# EAGLE design SparkFun_Ardumoto (EAGLE 7.7.0)

## Sheet 1 of 2
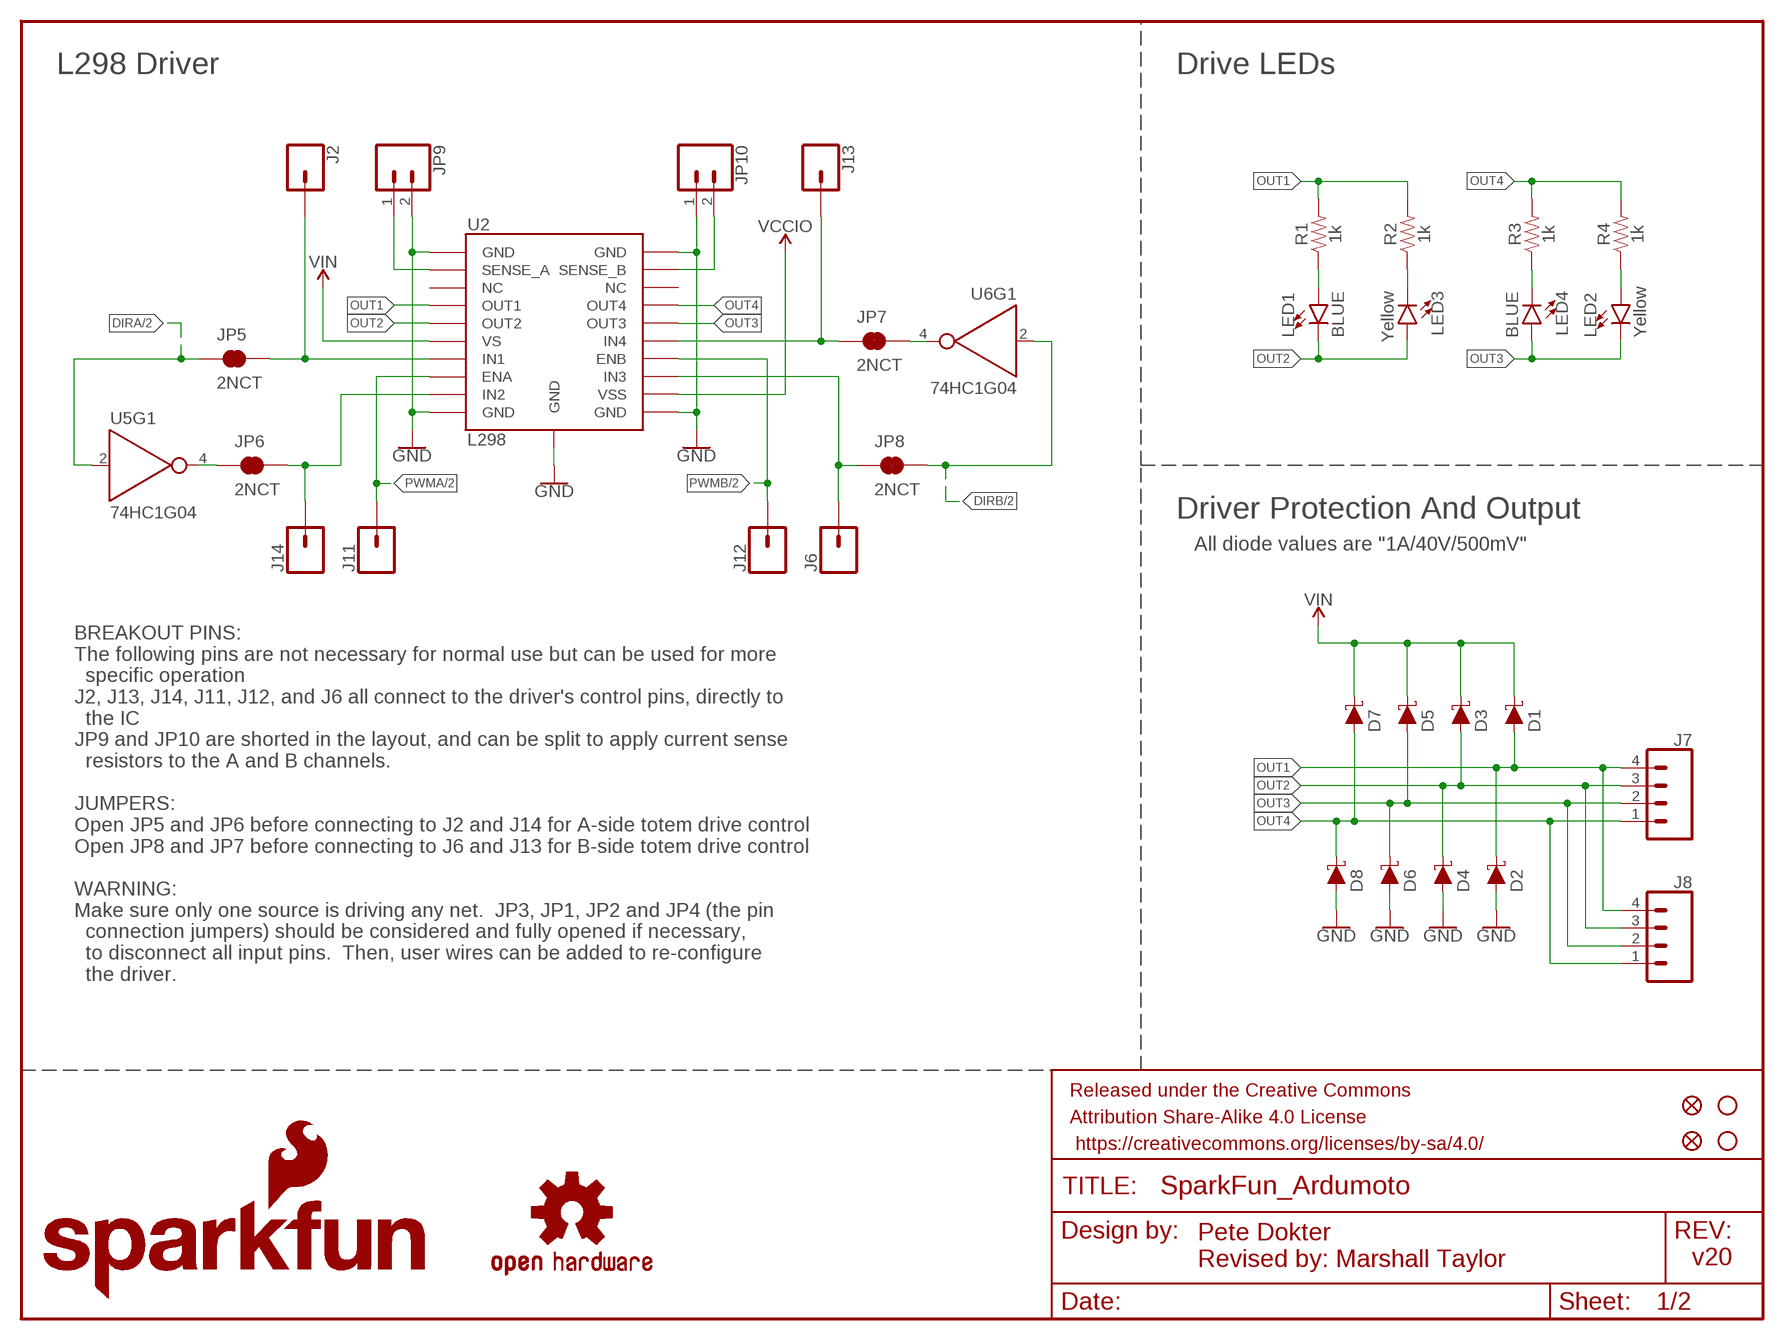
[diagram p0: schematic, sheet 1]

### Parts
D1  1A/40V/500mV  DIODE-SCHOTTKY-SS14  [SMA-DIODE]
D2  1A/40V/500mV  DIODE-SCHOTTKY-SS14  [SMA-DIODE]
D3  1A/40V/500mV  DIODE-SCHOTTKY-SS14  [SMA-DIODE]
D4  1A/40V/500mV  DIODE-SCHOTTKY-SS14  [SMA-DIODE]
D5  1A/40V/500mV  DIODE-SCHOTTKY-SS14  [SMA-DIODE]
D6  1A/40V/500mV  DIODE-SCHOTTKY-SS14  [SMA-DIODE]
D7  1A/40V/500mV  DIODE-SCHOTTKY-SS14  [SMA-DIODE]
D8  1A/40V/500mV  DIODE-SCHOTTKY-SS14  [SMA-DIODE]
FD1  FIDUCIALUFIDUCIAL  [MICRO-FIDUCIAL]
FD2  FIDUCIALUFIDUCIAL  [MICRO-FIDUCIAL]
FRAME2  FRAME-LETTERNO_PACKAGE  [DUMMY]
H1  STAND-OFF  [STAND-OFF]
H2  STAND-OFF  [STAND-OFF]
J2  CONN_01PTH_NO_SILK_YES_STOP  [1X01_NO_SILK]
J6  CONN_01PTH_NO_SILK_YES_STOP  [1X01_NO_SILK]
J7  CONN_04SCREW  [SCREWTERMINAL-3.5MM-4]
J8  CONN_04  [1X04]
J11  CONN_01PTH_NO_SILK_YES_STOP  [1X01_NO_SILK]
J12  CONN_01PTH_NO_SILK_YES_STOP  [1X01_NO_SILK]
J13  CONN_01PTH_NO_SILK_YES_STOP  [1X01_NO_SILK]
J14  CONN_01PTH_NO_SILK_YES_STOP  [1X01_NO_SILK]
JP5  2NCT  JUMPER-SMT_2_NC_TRACE_SILK  [SMT-JUMPER_2_NC_TRACE_SILK]
JP6  2NCT  JUMPER-SMT_2_NC_TRACE_SILK  [SMT-JUMPER_2_NC_TRACE_SILK]
JP7  2NCT  JUMPER-SMT_2_NC_TRACE_SILK  [SMT-JUMPER_2_NC_TRACE_SILK]
JP8  2NCT  JUMPER-SMT_2_NC_TRACE_SILK  [SMT-JUMPER_2_NC_TRACE_SILK]
JP9  CONN_021X02_NO_SILK  [1X02_NO_SILK]
JP10  CONN_021X02_NO_SILK  [1X02_NO_SILK]
LED1  BLUE  LED-BLUE0603  [LED-0603]
LED2  Yellow  LED-YELLOW0603  [LED-0603]
LED3  Yellow  LED-YELLOW0603  [LED-0603]
LED4  BLUE  LED-BLUE0603  [LED-0603]
LOGO2  SFE_LOGO_NAME_FLAME.1_INCH  [SFE_LOGO_NAME_FLAME_.1]
R1  1k  1KOHM-0603-1/10W-1%  [0603]
R2  1k  1KOHM-0603-1/10W-1%  [0603]
R3  1k  1KOHM-0603-1/10W-1%  [0603]
R4  1k  1KOHM-0603-1/10W-1%  [0603]
U2  L298  L298_SMD_W_PAD  [POWERSO20_L298_PAD]
U5  74HC1G04  [SOT353]
U6  74HC1G04  [SOT353]
U$1  OSHW-LOGOS  [OSHW-LOGO-S]

### Nets
DIRA: JP5.1 U5.2(A) ; also sheet 2
DIRB: JP8.2 U6.2(A) ; also sheet 2
GND: D2.A D4.A D6.A D8.A JP9.2 JP10.1 U2.1(GND) U2.10(GND) U2.11(GND) U2.20(GND) U2.PAD(GND) ; also sheet 2
IN1: J2.1 JP5.2 U2.7(IN1)
IN2: J14.1 JP6.2 U2.9(IN2)
IN3: J6.1 JP8.1 U2.13(IN3)
IN4: J13.1 JP7.1 U2.15(IN4)
N$4: LED1.A R1.1
N$5: LED3.C R2.1
N$8: LED4.C R3.1
N$9: LED2.A R4.1
NDIRA: JP6.1 U5.4(Y)
NDIRB: JP7.2 U6.4(Y)
OUT1: D1.A D2.C J7.4 J8.4 R1.2 R2.2 U2.4(OUT1)
OUT2: D3.A D4.C J7.3 J8.3 LED1.C LED3.A U2.5(OUT2)
OUT3: D5.A D6.C J7.2 J8.2 LED2.C LED4.A U2.16(OUT3)
OUT4: D7.A D8.C J7.1 J8.1 R3.2 R4.2 U2.17(OUT4)
PWMA: J11.1 U2.8(ENA) ; also sheet 2
PWMB: J12.1 U2.14(ENB) ; also sheet 2
SENA: JP9.1 U2.2(SENSE_A)
SENB: JP10.2 U2.19(SENSE_B)
VCCIO: U2.12(VSS) ; also sheet 2
VIN: D1.C D3.C D5.C D7.C U2.6(VS) ; also sheet 2
Unconnected: U2.3(NC) U2.18(NC)

### Notes on the sheet
- L298 Driver | Drive LEDs
- Driver Protection And Output
- All diode values are "1A/40V/500mV"
- BREAKOUT PINS:
  The following pins are not necessary for normal use but can be used for more
    specific operation
  J2, J13, J14, J11, J12, and J6 all connect to the driver's control pins, directly to
    the IC
  JP9 and JP10 are shorted in the layout, and can be split to apply current sense
    resistors to the A and B channels.
  
  JUMPERS:
  Open JP5 and JP6 before connecting to J2 and J14 for A-side totem drive control
  Open JP8 and JP7 before connecting to J6 and J13 for B-side totem drive control
  
  WARNING:
  Make sure only one source is driving any net.  JP3, JP1, JP2 and JP4 (the pin
    connection jumpers) should be considered and fully opened if necessary,
    to disconnect all input pins.  Then, user wires can be added to re-configure
    the driver.
- Pete Dokter
- Revised by: Marshall Taylor | v20

## Sheet 2 of 2
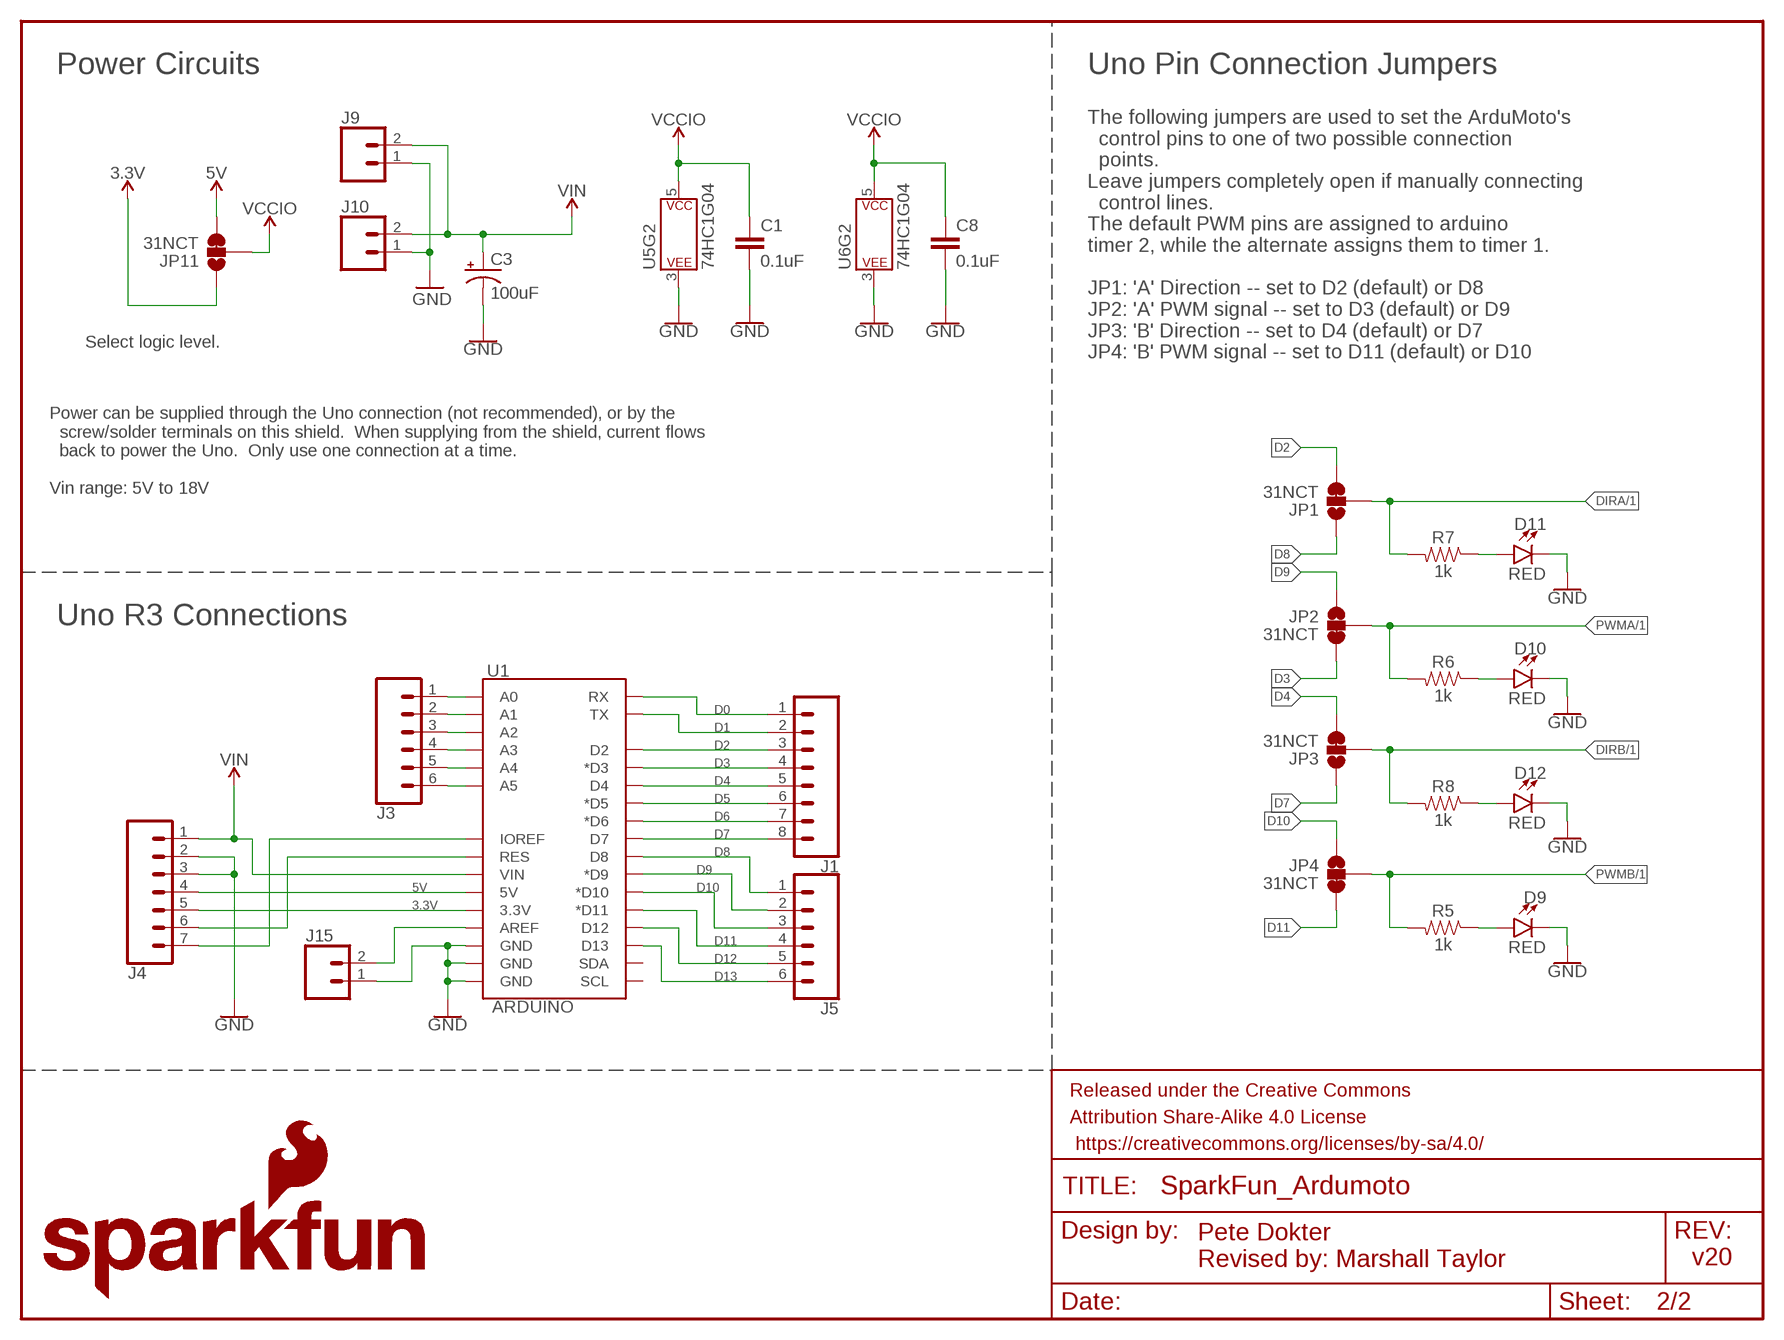
[diagram p1: schematic, sheet 2]

### Parts
C1  0.1uF  0.1UF-0603-25V-5%  [0603]
C3  100uF  100UF-POLAR-25V-20%(ELEC)  [PANASONIC_D]
C8  0.1uF  0.1UF-0603-25V-5%  [0603]
D9  RED  LED-RED0603  [LED-0603]
D10  RED  LED-RED0603  [LED-0603]
D11  RED  LED-RED0603  [LED-0603]
D12  RED  LED-RED0603  [LED-0603]
FRAME1  FRAME-LETTER  [CREATIVE_COMMONS]
J1  CONN_08NO_SILK_FEMALE_PTH  [1X08_NO_SILK]
J3  CONN_06NO_SILK_FEMALE_PTH  [1X06_NO_SILK]
J4  CONN_07NO_SILK  [1X07_NO_SILK]
J5  CONN_06NO_SILK_FEMALE_PTH  [1X06_NO_SILK]
J9  CONN_02  [1X02]
J10  CONN_023.5MM  [SCREWTERMINAL-3.5MM-2]
J15  CONN_021X02_NO_SILK  [1X02_NO_SILK]
JP1  31NCT  JUMPER-SMT_3_1-NC_TRACE_SILK  [SMT-JUMPER_3_1-NC_TRACE_SILK]
JP2  31NCT  JUMPER-SMT_3_1-NC_TRACE_SILK  [SMT-JUMPER_3_1-NC_TRACE_SILK]
JP3  31NCT  JUMPER-SMT_3_1-NC_TRACE_SILK  [SMT-JUMPER_3_1-NC_TRACE_SILK]
JP4  31NCT  JUMPER-SMT_3_1-NC_TRACE_SILK  [SMT-JUMPER_3_1-NC_TRACE_SILK]
JP11  31NCT  JUMPER-SMT_3_1-NC_TRACE_SILK  [SMT-JUMPER_3_1-NC_TRACE_SILK]
LOGO1  SFE_LOGO_NAME_FLAME.2_INCH  [SFE_LOGO_NAME_FLAME_.2]
R5  1k  1KOHM-0603-1/10W-1%  [0603]
R6  1k  1KOHM-0603-1/10W-1%  [0603]
R7  1k  1KOHM-0603-1/10W-1%  [0603]
R8  1k  1KOHM-0603-1/10W-1%  [0603]
U1  ARDUINO  ARDUINO_UNO_R3_SHIELDNOLABELS  [UNO_R3_SHIELD_NOLABELS]

### Nets
3.3V: J4.5 JP11.1 U1.3.3V
5V: J4.4 JP11.3 U1.5V
D0: J1.1 U1.RX
D1: J1.2 U1.TX
D2: J1.3 JP1.3 U1.D2
D3: J1.4 JP2.3 U1.D3(*D3)
D4: J1.5 JP3.3 U1.D4
D5: J1.6 U1.D5(*D5)
D6: J1.7 U1.D6(*D6)
D7: J1.8 JP3.1 U1.D7
D8: J5.1 JP1.1 U1.D8
D9: J5.2 JP2.1 U1.D9(*D9)
D10: J5.3 JP4.1 U1.D10(*D10)
D11: J5.4 JP4.3 U1.D11(*D11)
D12: J5.5 U1.D12
D13: J5.6 U1.D13
DIRA: JP1.2 R7.2 ; also sheet 1
DIRB: JP3.2 R8.2 ; also sheet 1
GND: C1.2 C3.- C8.2 D9.C D10.C D11.C D12.C J4.2 J4.3 J9.1 J10.1 J15.1 U1.GND@0(GND) U1.GND@1(GND) U1.GND@2(GND) U5.3(P$V-) U6.3(P$V-) ; also sheet 1
IOREF: J4.7 U1.IOREF
N$10: J15.2 U1.AREF
N$21: J3.1 U1.A0
N$22: J3.2 U1.A1
N$23: J3.3 U1.A2
N$24: J3.4 U1.A3
N$25: J3.5 U1.A4
N$26: J3.6 U1.A5
N$36: D9.A R5.1
N$37: D10.A R6.1
N$38: D12.A R8.1
N$39: D11.A R7.1
PWMA: JP2.2 R6.2 ; also sheet 1
PWMB: JP4.2 R5.2 ; also sheet 1
RESET: J4.6 U1.RES
VCCIO: C1.1 C8.1 JP11.2 U5.5(P$V+) U6.5(P$V+) ; also sheet 1
VIN: C3.+ J4.1 J9.2 J10.2 U1.VIN ; also sheet 1
Unconnected: U1.SCL U1.SDA

### Notes on the sheet
- Power Circuits | Uno Pin Connection Jumpers
- The following jumpers are used to set the ArduMoto's
    control pins to one of two possible connection
    points.
  Leave jumpers completely open if manually connecting
    control lines.
  The default PWM pins are assigned to arduino
  timer 2, while the alternate assigns them to timer 1.
  
  JP1: 'A' Direction -- set to D2 (default) or D8
  JP2: 'A' PWM signal -- set to D3 (default) or D9
  JP3: 'B' Direction -- set to D4 (default) or D7
  JP4: 'B' PWM signal -- set to D11 (default) or D10
- Select logic level.
- Power can be supplied through the Uno connection (not recommended), or by the
    screw/solder terminals on this shield.  When supplying from the shield, current flows
    back to power the Uno.  Only use one connection at a time.
  
  Vin range: 5V to 18V
- Uno R3 Connections
- Pete Dokter
- Revised by: Marshall Taylor | v20

## Library data of the parts
C1 C8 = SparkFun-Capacitors:0.1UF: 0.1µF ceramic capacitors A capacitor is a passive two-terminal electrical component used to store electrical energy temporarily in an electric field.; PROD_ID: CAP-08604
C3 = SparkFun-Capacitors:100UF-POLAR: 100µF polarized capacitors A capacitor is a passive two-terminal electrical component used to store electrical energy temporarily in an electric field.; PROD_ID: CAP-12547
D1-D8 = SparkFun-DiscreteSemi:DIODE-SCHOTTKY: Schottky diode A Schottky diode is a semiconductor diode which has a low forward voltage drop and a very fast switching action.; PROD_ID: DIO-08053
D9-D12 = SparkFun-LED:LED-RED: Red SMD LED Used in manufacturing of most products at SparkFun Packages: 0603 - SMD 0603 package [Product Link] <http://docs.avagotech.com/docs/AV02-0551EN> 0603 SMART - SMD 0603 SMART package ( more efficient and expensive)[Product Link] <http://www.osram-os.com/Graphics/XPic2/00077099_0.pdf> 1206 - SMD1206 package [Product Link] <https://www.sparkfun.com/datasheets/DevTools/LilyPad/Q150OVS4.pdff> SparkFun Products: Pro Mini 328 -5V <https://www.sparkfun.com/products/821> RedBoard <https://www.sparkfun.com/products/12757> IOIO-OTG <https://www.sparkfun.com/products/13613>; PROD_ID: DIO-00819
FD1 FD2 = SparkFun:FIDUCIAL: Fiducial Alignment Points Various fiducial points for machine vision alignment.
FRAME1 = SparkFun-Aesthetics:FRAME-LETTER: Schematic Frame - Letter Standard 8.5x11 US Letter frame
FRAME2 = SparkFun-Aesthetics:FRAME-LETTER: Schematic Frame - Letter Standard 8.5x11 US Letter frame; DESIGNER: Nobody; VERSION: v01
H1 H2 = SparkFun-Hardware:STAND-OFF: Stand Off Drill holes for mechanically mounting via screws, standoffs, etc. Note: Use the keepout ring to avoid running the screw head into surrounding components. Variant Overviews STAND-OFF - Mechanical footprint for a #4 phillips button head screw. STAND-OFF-TIGHT - Mechanical footprint for a #4 phillips button head screw, Example SparkFun Products Screw - Phillips Head (1/4", 4-40, 10 pack) <https://www.sparkfun.com/products/10453> (PRT-10453) Screw - Phillips Head (1/2", 4-40, 10 pack) <https://www.sparkfun.com/products/10452> (PRT-10452) Screw - Phillips Head (3/4", 4-40, 10 pack) <https://www.sparkfun.com/products/10451> (PRT-10451) Screw - Phillips Head (1", 4-40, 10 pack) <https://www.sparkfun.com/products/10450> (PRT-10450)
J1 = SparkFun-Connectors:CONN_08: Multi connection point. Often used as Generic Header-pin footprint for 0.1 inch spaced/style header connections On any of the 0.1 inch spaced packages, you can populate with these: Break Away Headers - Straight <https://www.sparkfun.com/products/116> (PRT-00116) Break Away Male Headers - Right Angle <https://www.sparkfun.com/products/553> (PRT-00553) Female Headers <https://www.sparkfun.com/products/115> (PRT-00115) Break Away Headers - Machine Pin <https://www.sparkfun.com/products/117> (PRT-00117) Break Away Female Headers - Swiss Machine Pin <https://www.sparkfun.com/products/743> (PRT-00743) Arduino Stackable Header - 8 Pin <https://www.sparkfun.com/products/9279> (PRT-09279) For SCREWTERMINALS and SPRING TERMINALS visit here: Screw Terimnals on SparkFun.com <https://www.sparkfun.com/search/results?term=Screw+Terminals> (5mm/3.5mm/2.54mm spacing) This device is also useful as a general connection point to wire up your design to another part of your project. Our various solder wires solder well into these plated through hole pads. Hook-Up Wire - Assortment (Stranded, 22 AWG) <https://www.sparkfun.com/products/11375> (PRT-11375) Hook-Up Wire - Assortment (Solid Core, 22 AWG) <https://www.sparkfun.com/products/11367> (PRT-11367) View the entire wire category on our website here <https://www.sparkfun.com/categories/141> Special notes: Molex polarized connector foot print use with SKU : PRT-08231 with associated crimp pins and housings. 1MM SMD Version SKU: PRT-10208 NOTES ON THE VARIANTS LOCK and LOCK_LONGPADS... This footprint was designed to help hold the alignment of a through-hole component (i.e. 6-pin header) while soldering it into place. You may notice that each hole has been shifted either up or down by 0.005 of an inch from it's more standard position (which is a perfectly straight line). This slight alteration caused the pins (the squares in the middle) to touch the edges of the holes. Because they are alternating, it causes a "brace" to hold the component in place. 0.005 has proven to be the perfect amount of "off-center" position when using our standard breakaway headers. Although looks a little odd when you look at the bare footprint, once you have a header in there, the alteration is very hard to notice. Also,if you push a header all the way into place, it is covered up entirely on the bottom side.; PROD_ID: CONN-08438
J2 J6 J11-J14 = SparkFun-Connectors:CONN_01: Single connection point. Often used as Generic Header-pin footprint for 0.1 inch spaced/style header connections On any of the 0.1 inch spaced packages, you can populate with these: Break Away Headers - Straight <https://www.sparkfun.com/products/116> (PRT-00116) Break Away Male Headers - Right Angle <https://www.sparkfun.com/products/553> (PRT-00553) Female Headers <https://www.sparkfun.com/products/115> (PRT-00115) Break Away Headers - Machine Pin <https://www.sparkfun.com/products/117> (PRT-00117) Break Away Female Headers - Swiss Machine Pin <https://www.sparkfun.com/products/743> (PRT-00743) This device is also useful as a general connection point to wire up your design to another part of your project. Our various solder wires solder well into these plated through hole pads. Hook-Up Wire - Assortment (Stranded, 22 AWG) <https://www.sparkfun.com/products/11375> (PRT-11375) Hook-Up Wire - Assortment (Solid Core, 22 AWG) <https://www.sparkfun.com/products/11367> (PRT-11367) View the entire wire category on our website here <https://www.sparkfun.com/categories/141> Special notes: SMTSO-256-ET is a "flush mount" nut for a 4-40 screw. We mostly use this on specialty testbeds; it is a nice way to connect hardware to your PCB at an adjustable hieght. Also note, the SNAP packages are for using a snappable style connector. We sell a baggie of snaps and they are also used on two LilyPad designs: Snap Assortment - 30 pack (male and female) <https://www.sparkfun.com/products/11347> (DEV-11347) LilyPad Arduino SimpleSnap <https://www.sparkfun.com/products/10941> (DEV-10941) LilyPad SimpleSnap Protoboard <https://www.sparkfun.com/products/10940> (DEV-10940)
J3 J5 = SparkFun-Connectors:CONN_06: Multi connection point. Often used as Generic Header-pin footprint for 0.1 inch spaced/style header connections On any of the 0.1 inch spaced packages, you can populate with these: Break Away Headers - Straight <https://www.sparkfun.com/products/116> (PRT-00116) Break Away Male Headers - Right Angle <https://www.sparkfun.com/products/553> (PRT-00553) Female Headers <https://www.sparkfun.com/products/115> (PRT-00115) Break Away Headers - Machine Pin <https://www.sparkfun.com/products/117> (PRT-00117) Break Away Female Headers - Swiss Machine Pin <https://www.sparkfun.com/products/743> (PRT-00743) Arduino Stackable Header - 6 Pin <https://www.sparkfun.com/products/9280> (PRT-09280) For SCREWTERMINALS and SPRING TERMINALS visit here: Screw Terimnals on SparkFun.com <https://www.sparkfun.com/search/results?term=Screw+Terminals> (5mm/3.5mm/2.54mm spacing) This device is also useful as a general connection point to wire up your design to another part of your project. Our various solder wires solder well into these plated through hole pads. Hook-Up Wire - Assortment (Stranded, 22 AWG) <https://www.sparkfun.com/products/11375> (PRT-11375) Hook-Up Wire - Assortment (Solid Core, 22 AWG) <https://www.sparkfun.com/products/11367> (PRT-11367) View the entire wire category on our website here <https://www.sparkfun.com/categories/141>; PROD_ID: CONN-08437
J4 = SparkFun-Connectors:CONN_07: Multi connection point. Often used as Generic Header-pin footprint for 0.1 inch spaced/style header connections On any of the 0.1 inch spaced packages, you can populate with these: Break Away Headers - Straight <https://www.sparkfun.com/products/116> (PRT-00116) Break Away Male Headers - Right Angle <https://www.sparkfun.com/products/553> (PRT-00553) Female Headers <https://www.sparkfun.com/products/115> (PRT-00115) Break Away Headers - Machine Pin <https://www.sparkfun.com/products/117> (PRT-00117) Break Away Female Headers - Swiss Machine Pin <https://www.sparkfun.com/products/743> (PRT-00743) For SCREWTERMINALS and SPRING TERMINALS visit here: Screw Terimnals on SparkFun.com <https://www.sparkfun.com/search/results?term=Screw+Terminals> (5mm/3.5mm/2.54mm spacing) This device is also useful as a general connection point to wire up your design to another part of your project. Our various solder wires solder well into these plated through hole pads. Hook-Up Wire - Assortment (Stranded, 22 AWG) <https://www.sparkfun.com/products/11375> (PRT-11375) Hook-Up Wire - Assortment (Solid Core, 22 AWG) <https://www.sparkfun.com/products/11367> (PRT-11367) View the entire wire category on our website here <https://www.sparkfun.com/categories/141> Special notes: Molex polarized connector foot print use with SKU : PRT-08231 with associated crimp pins and housings. 1MM SMD Version SKU: PRT-10208 NOTES ON THE VARIANTS LOCK and LOCK_LONGPADS... This footprint was designed to help hold the alignment of a through-hole component (i.e. 6-pin header) while soldering it into place. You may notice that each hole has been shifted either up or down by 0.005 of an inch from it's more standard position (which is a perfectly straight line). This slight alteration caused the pins (the squares in the middle) to touch the edges of the holes. Because they are alternating, it causes a "brace" to hold the component in place. 0.005 has proven to be the perfect amount of "off-center" position when using our standard breakaway headers. Although looks a little odd when you look at the bare footprint, once you have a header in there, the alteration is very hard to notice. Also,if you push a header all the way into place, it is covered up entirely on the bottom side.
J7 = SparkFun-Connectors:CONN_04: Multi connection point. Often used as Generic Header-pin footprint for 0.1 inch spaced/style header connections On any of the 0.1 inch spaced packages, you can populate with these: Break Away Headers - Straight <https://www.sparkfun.com/products/116> (PRT-00116) Break Away Male Headers - Right Angle <https://www.sparkfun.com/products/553> (PRT-00553) Female Headers <https://www.sparkfun.com/products/115> (PRT-00115) Break Away Headers - Machine Pin <https://www.sparkfun.com/products/117> (PRT-00117) Break Away Female Headers - Swiss Machine Pin <https://www.sparkfun.com/products/743> (PRT-00743) For SCREWTERMINALS and SPRING TERMINALS visit here: Screw Terimnals on SparkFun.com <https://www.sparkfun.com/search/results?term=Screw+Terminals> (5mm/3.5mm/2.54mm spacing) This device is also useful as a general connection point to wire up your design to another part of your project. Our various solder wires solder well into these plated through hole pads. Hook-Up Wire - Assortment (Stranded, 22 AWG) <https://www.sparkfun.com/products/11375> (PRT-11375) Hook-Up Wire - Assortment (Solid Core, 22 AWG) <https://www.sparkfun.com/products/11367> (PRT-11367) View the entire wire category on our website here <https://www.sparkfun.com/categories/141> Special notes: Molex polarized connector foot print use with SKU : PRT-08231 with associated crimp pins and housings. 1MM SMD Version SKU: PRT-10208; PROD_ID: 2xCONN-08399; SF_ID: 2xPRT-08084
J8 = SparkFun-Connectors:CONN_04: Multi connection point. Often used as Generic Header-pin footprint for 0.1 inch spaced/style header connections On any of the 0.1 inch spaced packages, you can populate with these: Break Away Headers - Straight <https://www.sparkfun.com/products/116> (PRT-00116) Break Away Male Headers - Right Angle <https://www.sparkfun.com/products/553> (PRT-00553) Female Headers <https://www.sparkfun.com/products/115> (PRT-00115) Break Away Headers - Machine Pin <https://www.sparkfun.com/products/117> (PRT-00117) Break Away Female Headers - Swiss Machine Pin <https://www.sparkfun.com/products/743> (PRT-00743) For SCREWTERMINALS and SPRING TERMINALS visit here: Screw Terimnals on SparkFun.com <https://www.sparkfun.com/search/results?term=Screw+Terminals> (5mm/3.5mm/2.54mm spacing) This device is also useful as a general connection point to wire up your design to another part of your project. Our various solder wires solder well into these plated through hole pads. Hook-Up Wire - Assortment (Stranded, 22 AWG) <https://www.sparkfun.com/products/11375> (PRT-11375) Hook-Up Wire - Assortment (Solid Core, 22 AWG) <https://www.sparkfun.com/products/11367> (PRT-11367) View the entire wire category on our website here <https://www.sparkfun.com/categories/141> Special notes: Molex polarized connector foot print use with SKU : PRT-08231 with associated crimp pins and housings. 1MM SMD Version SKU: PRT-10208; PROD_ID: CONN-09696
J9 J15 JP9 JP10 = SparkFun-Connectors:CONN_02: Multi connection point. Often used as Generic Header-pin footprint for 0.1 inch spaced/style header connections On any of the 0.1 inch spaced packages, you can populate with these: Break Away Headers - Straight <https://www.sparkfun.com/products/116> (PRT-00116) Break Away Male Headers - Right Angle <https://www.sparkfun.com/products/553> (PRT-00553) Female Headers <https://www.sparkfun.com/products/115> (PRT-00115) Break Away Headers - Machine Pin <https://www.sparkfun.com/products/117> (PRT-00117) Break Away Female Headers - Swiss Machine Pin <https://www.sparkfun.com/products/743> (PRT-00743) For SCREWTERMINALS and SPRING TERMINALS visit here: Screw Terimnals on SparkFun.com <https://www.sparkfun.com/search/results?term=Screw+Terminals> (5mm/3.5mm/2.54mm spacing) This device is also useful as a general connection point to wire up your design to another part of your project. Our various solder wires solder well into these plated through hole pads. Hook-Up Wire - Assortment (Stranded, 22 AWG) <https://www.sparkfun.com/products/11375> (PRT-11375) Hook-Up Wire - Assortment (Solid Core, 22 AWG) <https://www.sparkfun.com/products/11367> (PRT-11367) View the entire wire category on our website here <https://www.sparkfun.com/categories/141> Special notes: Molex polarized connector foot print use with: PRT-08233 with associated crimp pins and housings. 2.54_SCREWTERM for use with PRT-10571. 3.5mm Screw Terminal footprints for PRT-08084 5mm Screw Terminal footprints for use with PRT-08432
J10 = SparkFun-Connectors:CONN_02: Multi connection point. Often used as Generic Header-pin footprint for 0.1 inch spaced/style header connections On any of the 0.1 inch spaced packages, you can populate with these: Break Away Headers - Straight <https://www.sparkfun.com/products/116> (PRT-00116) Break Away Male Headers - Right Angle <https://www.sparkfun.com/products/553> (PRT-00553) Female Headers <https://www.sparkfun.com/products/115> (PRT-00115) Break Away Headers - Machine Pin <https://www.sparkfun.com/products/117> (PRT-00117) Break Away Female Headers - Swiss Machine Pin <https://www.sparkfun.com/products/743> (PRT-00743) For SCREWTERMINALS and SPRING TERMINALS visit here: Screw Terimnals on SparkFun.com <https://www.sparkfun.com/search/results?term=Screw+Terminals> (5mm/3.5mm/2.54mm spacing) This device is also useful as a general connection point to wire up your design to another part of your project. Our various solder wires solder well into these plated through hole pads. Hook-Up Wire - Assortment (Stranded, 22 AWG) <https://www.sparkfun.com/products/11375> (PRT-11375) Hook-Up Wire - Assortment (Solid Core, 22 AWG) <https://www.sparkfun.com/products/11367> (PRT-11367) View the entire wire category on our website here <https://www.sparkfun.com/categories/141> Special notes: Molex polarized connector foot print use with: PRT-08233 with associated crimp pins and housings. 2.54_SCREWTERM for use with PRT-10571. 3.5mm Screw Terminal footprints for PRT-08084 5mm Screw Terminal footprints for use with PRT-08432; PROD_ID: CONN-08399
JP1-JP4 JP11 = SparkFun-Jumpers:JUMPER-SMT_3_1-NC_TRACE: Normally closed trace jumper (1 of 2 connections) This jumper has a trace between two pads so it's normally closed (NC). The other connection is normally open (NO). Use a razor knife to open the connection. For best results follow the IPC guidelines for cutting traces: Cutout at least 0.063 mm (0.005 in). Remove all loose material to clean up the cut area. Seal the cut with an approved epoxy. Reapply solder to reclose the connection, or to close the NO connection.
JP5-JP8 = SparkFun-Jumpers:JUMPER-SMT_2_NC_TRACE: Normally closed trace jumper This jumper has a trace between two pads so it's normally closed (NC). Use a razor knife to open the connection. For best results follow the IPC guidelines for cutting traces: Cutout at least 0.063 mm (0.005 in). Remove all loose material to clean up the cut area. Seal the cut with an approved epoxy. Reapply solder to reclose the connection.
LED1 LED4 = SparkFun-LED:LED-BLUE: Blue SMD LED Used in manufacturing of various products at SparkFun Packages: 0603 - SMD 0603 package [Product Link] <http://www.digikey.com/product-detail/en/SMLE12BC7TT86/511-1589-2-ND/1641808> 1206 - SMD1206 package [Product Link] <http://www.digikey.com/product-detail/en/lite-on-inc/LTST-C150TBKT/160-1643-1-ND/573584> SparkFun Products: ESP8266 Thing-Dev Board <https://www.sparkfun.com/products/13711> RedBoard <https://www.sparkfun.com/products/12757>; PROD_ID: DIO-08575
LED2 LED3 = SparkFun-LED:LED-YELLOW: Yellow SMD LED Used in manufacturing several products at SparkFun. Packages: 0603 - SMD 0603 package[Product Link] <http://www.kingbrightusa.com/product.asp?catalog_name=LED&product_id=APT1608SYCK> 0603 -SMART - SMART SMD 0603 package (more efficient/more expensive) [Product Link] <http://www.osram-os.com/osram_os/en/products/product-catalog/led-light-emitting-diodes/smartled-0603/ly-l29k/index.jsp> LilyPad - SMD1206 package[Product Datasheet] <https://www.sparkfun.com/datasheets/DevTools/LilyPad/Q150YUS4.pdf> SparkFun Products: Blynk Board <https://www.sparkfun.com/products/13794> IOIO-OTG <https://www.sparkfun.com/products/13613> XBee Explorer Serial <https://www.sparkfun.com/products/13225>; PROD_ID: DIO-09003
LOGO1 LOGO2 = SparkFun-Aesthetics:SFE_LOGO_NAME_FLAME: SparkFun Font Logo w/ Flame This is the SparkFun full logo. The logo on the schematic will always be the same size; the package variant is the height of the flame part of the logo. Default layer for the logo on the board is tSilk.
R1-R8 = SparkFun-Resistors:1KOHM: 1kΩ resistor A resistor is a passive two-terminal electrical component that implements electrical resistance as a circuit element. Resistors act to reduce current flow, and, at the same time, act to lower voltage levels within circuits. - Wikipedia; PROD_ID: RES-07856
U1 = SparkFun-Boards:ARDUINO_UNO_R3_SHIELD: Arduino R3 Shield Footprint Shield form compatible with the Arduino Uno R3. SparkFun Products: MG2639 Cellular Shield <https://www.sparkfun.com/products/13120> MIDI Shield <https://www.sparkfun.com/products/12898> R3 Stackable Headers Kit <https://www.sparkfun.com/products/11417>
U2 = SparkFun-IC-Special-Function:L298_SMD_W_PAD: Full-bridge power driver IC This device uses the ground pad under the IC; PROD_ID: IC-09133
U5 U6 = SparkFun-IC-Logic:74*1G04: Single Inverter IC NOT GATE INVERTER SNGL 1IN SOT353 Supply: 1.65V to 5.5V Datasheet <http://diodes.com/datasheets/74LVC1G04.pdf> SparkFun Products SparkFun Stepoko <https://www.sparkfun.com/products/13899> (ROB-13899) SparkFun CryptoShield <https://www.sparkfun.com/products/13183> (DEV-13183) SparkFun LogicBlocks Kit <https://www.sparkfun.com/products/11006> (KIT-11006) SparkFun ArduMoto <https://www.sparkfun.com/products/9815> (DEV-09815); PROD_ID: COMP-08268
U$1 = SparkFun:OSHW-LOGO: Open Source Hardware Logo This logo indicates the piece of hardware it is found on incorporates a OSHW license and/or adheres to the definition of open source hardware found here: http://freedomdefined.org/OSHW

## Net classes
1 power: width 0.61 mm

## Board
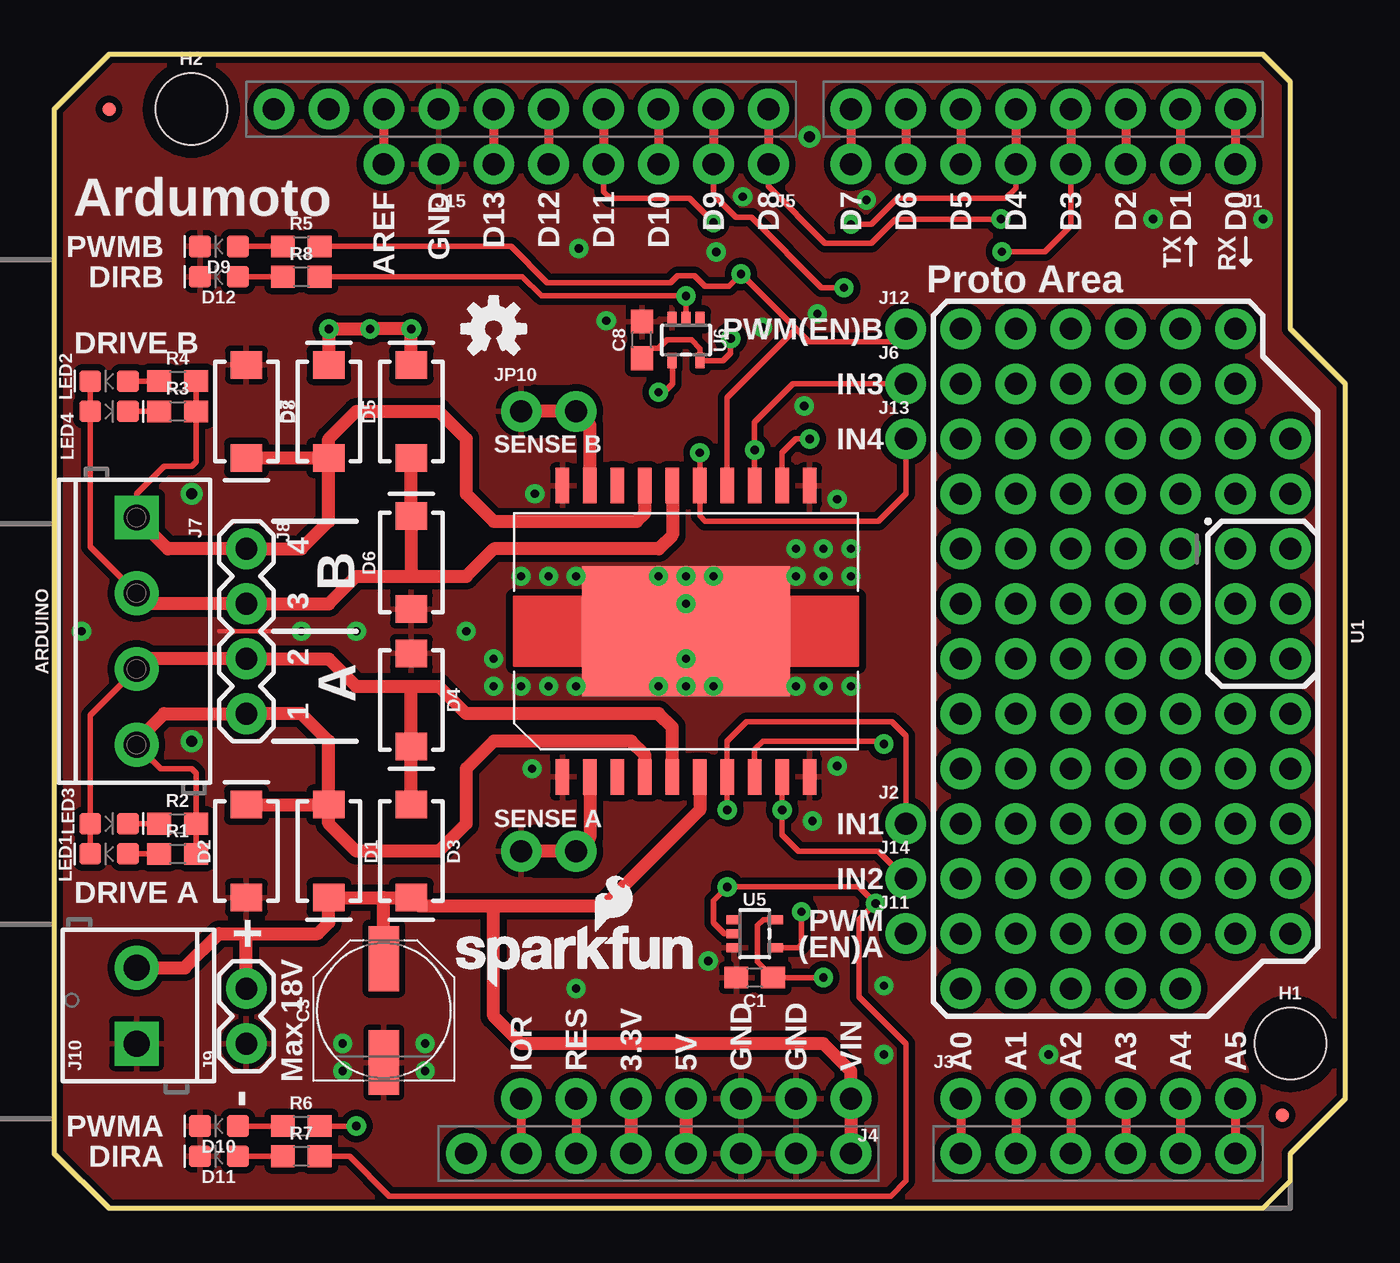
[diagram p2: board, top side]
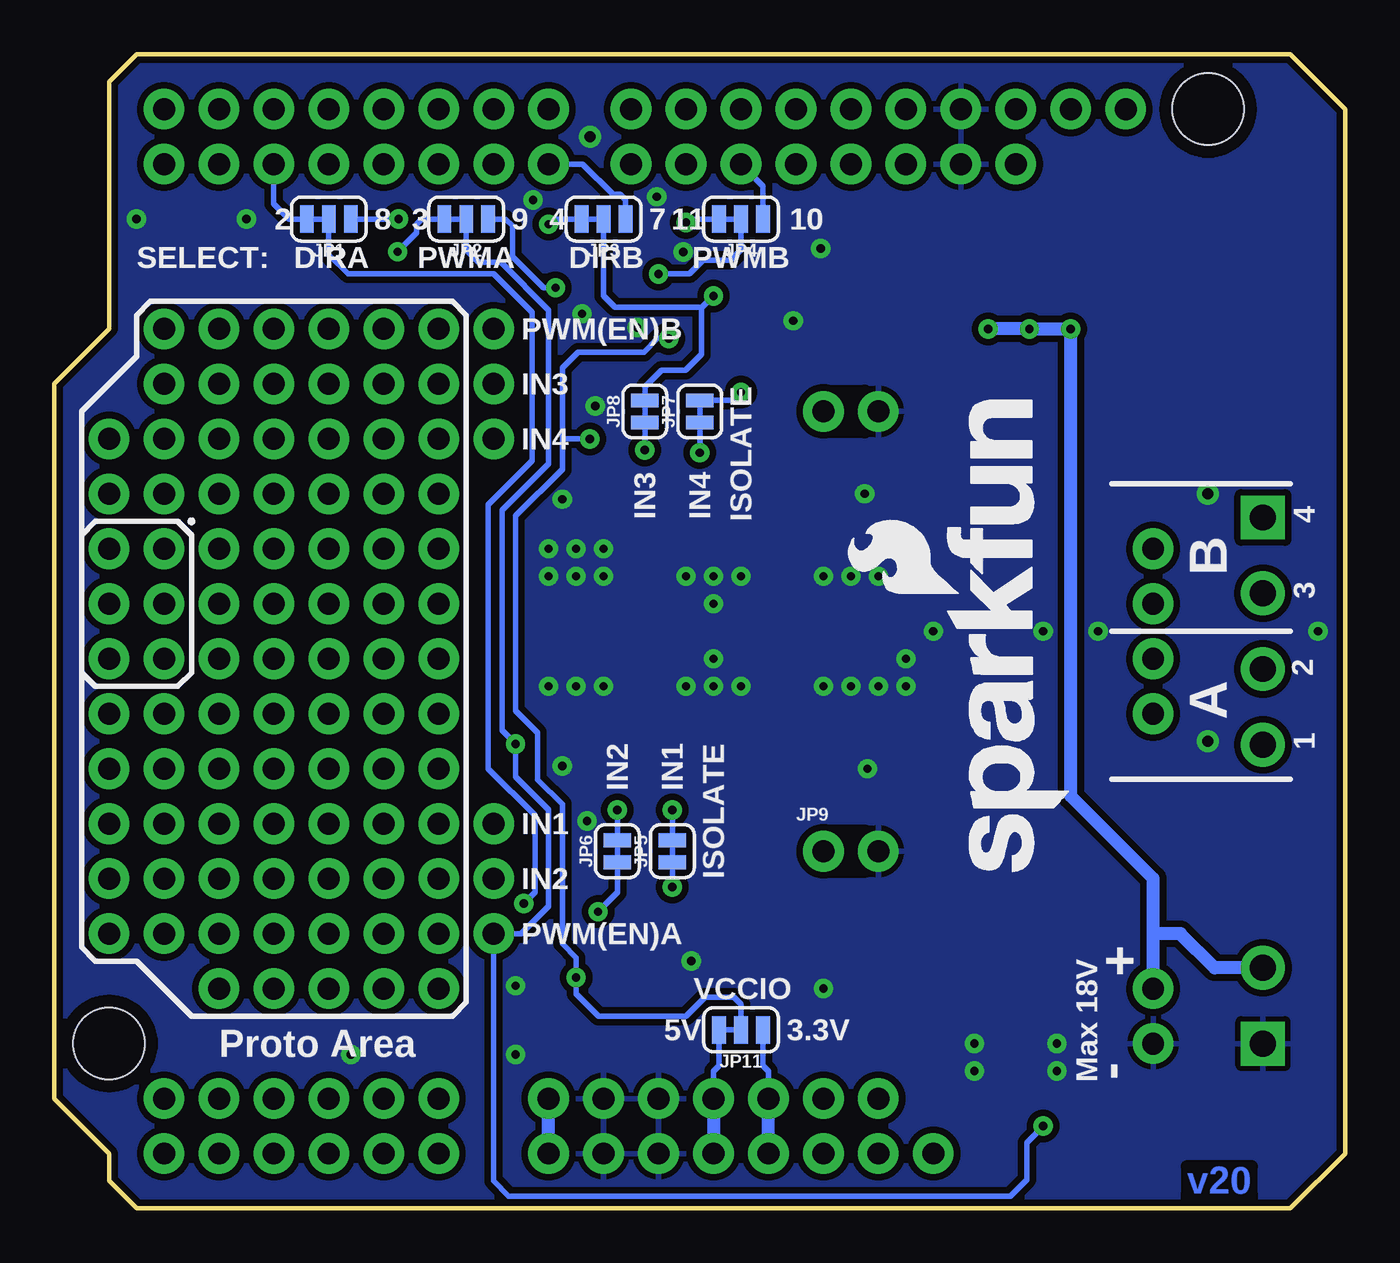
[diagram p3: board, bottom side, seen from below]

Size 59.69 x 53.34 mm. Coordinates in mm from the lower left corner, seen from the top.
Outline: 0,50.8 0,2.54 2.54,0 55.88,0 57.15,1.27 57.15,2.54 59.69,5.08 59.69,38.1 57.15,40.64 57.15,52.07 55.88,53.34 2.54,53.34 0,50.8
Copper layers (1*16): Top 0.035mm / dielectric 1.5mm / Bottom 0.035mm
Design rules "SparkFun-2-layer-STANDARD": minimum track width 10mil, minimum drill 20mil, track to track 10mil, track to pad 8mil, pad to pad 8mil, via to via 10mil, smd to smd 8mil, copper to edge 8mil, drill to drill 8mil, minimum pad ring 10mil, minimum via ring 10mil, stop-mask expansion 4mil, vias tented up to drill 25mil, thermal gap 10mil
tRestrict: area 22.2,15.6 to 25,17.4; area 22.2,36 to 25,37.7
bRestrict: area 22.2,15.6 to 25,17.4; area 22.2,36 to 25,37.7

### Footprints (pad centres in the part's own frame; a part is rotated, then mirrored left to right if it is on the bottom)
0603 = smd 1.1 x 1: 1 -0.85,0; 2 0.85,0
PANASONIC_D = smd 3 x 1.4: + 2.4,0; - -2.4,0
SMA-DIODE = smd 1.27 x 1.47: A -2.15,0; C 2.15,0
LED-0603 = smd 1 x 1: A -0.877,0; C 0.877,0
MICRO-FIDUCIAL = smd 0.635 x 0.635: 1 0,0
STAND-OFF = hole 3.302: 0,0
1X08_NO_SILK = drill 1.016 pad 1.88: 1 0,0; 2 2.54,0; 3 5.08,0; 4 7.62,0; 5 10.16,0; 6 12.7,0; 7 15.24,0; 8 17.78,0
1X01_NO_SILK = drill 1.016 pad 1.88: 1 0,0
1X06_NO_SILK = drill 1.016 pad 1.88: 1 0,0; 2 2.54,0; 3 5.08,0; 4 7.62,0; 5 10.16,0; 6 12.7,0
1X07_NO_SILK = drill 1.016 pad 1.88: 1 0,0; 2 2.54,0; 3 5.08,0; 4 7.62,0; 5 10.16,0; 6 12.7,0; 7 15.24,0
SCREWTERMINAL-3.5MM-4 = drill 1.2 pad 2.032 square: 1 0,0 | drill 1.2 pad 2.032: 2 3.5,0; 3 7,0; 4 10.5,0
1X04 = drill 1.016 pad 1.88: 1 0,0; 2 2.54,0; 3 5.08,0; 4 7.62,0
1X02 = drill 1.016 pad 1.88: 1 0,0; 2 2.54,0
SCREWTERMINAL-3.5MM-2 = drill 1.2 pad 2.032 square: 1 0,0 | drill 1.2 pad 2.032: 2 3.5,0
1X02_NO_SILK = drill 1.016 pad 1.88: 1 0,0; 2 2.54,0
SMT-JUMPER_3_1-NC_TRACE_SILK = smd 0.635 x 1.27: 1 -1.016,0; 2 0,0; 3 1.016,0
SMT-JUMPER_2_NC_TRACE_SILK = smd 0.635 x 1.27: 1 -0.508,0; 2 0.508,0
UNO_R3_SHIELD_NOLABELS = drill 1.016 pad 1.88: 3.3V 24.13,-3.81; 5V 24.13,-1.27; A0 24.13,11.43; A1 24.13,13.97; A2 24.13,16.51; A3 24.13,19.05; A4 24.13,21.59; A5 24.13,24.13; AREF -24.13,-15.24; D2 -24.13,19.05; D3 -24.13,16.51; D4 -24.13,13.97; D5 -24.13,11.43; D6 -24.13,8.89; D7 -24.13,6.35; D8 -24.13,2.54; D9 -24.13,0; D10 -24.13,-2.54; D11 -24.13,-5.08; D12 -24.13,-7.62; D13 -24.13,-10.16; GND@0 24.13,1.27; GND@1 24.13,3.81; GND@2 -24.13,-12.7; IOREF 24.13,-8.89; NC 24.13,-11.43; RES 24.13,-6.35; RX -24.13,24.13; SCL -24.13,-20.32; SDA -24.13,-17.78; TX -24.13,21.59; VIN 24.13,6.35
POWERSO20_L298_PAD = smd 1.651 x 0.635: 1 -6.731,5.715; 2 -6.731,4.445; 3 -6.731,3.175; 4 -6.731,1.905; 5 -6.731,0.635; 6 -6.731,-0.635; 7 -6.731,-1.905; 8 -6.731,-3.175; 9 -6.731,-4.445; 10 -6.731,-5.715; 11 6.731,-5.715; 12 6.731,-4.445; 13 6.731,-3.175; 14 6.731,-1.905; 15 6.731,-0.635; 16 6.731,0.635; 17 6.731,1.905; 18 6.731,3.175; 19 6.731,4.445; 20 6.731,5.715 | smd 5.994 x 9.601: PAD 0,0
SOT353 = smd 0.42 x 0.7: 1 -0.65,-0.95; 2 0,-0.95; 3 0.65,-0.95; 4 0.65,0.95; 5 -0.65,0.95

### Placement (x,y rotation side)
C1  32.38,10.67 180 top
C3  15.24,9.14 90 top
C8  27.18,40.13 90 top
D1  12.7,16.51 270 top
D2  8.89,16.51 90 top
D3  16.51,16.51 270 top
D4  16.51,23.5 270 top
D5  16.51,36.83 90 top
D6  16.51,29.84 90 top
D7  12.7,36.83 90 top
D8  8.89,36.83 270 top
D9  7.62,44.45 180 top
D10  7.62,3.81 180 top
D11  7.62,2.41 180 top
D12  7.62,43.05 180 top
FD1  2.54,50.8 0 top
FD2  56.77,4.32 0 top
FRAME1  -2.56,-15.24 0 top  (outside the outline)
FRAME2  -22.86,-11.43 0 top  (outside the outline)
H1  57.15,7.62 0 top
H2  6.35,50.8 0 top
J1  54.61,48.26 180 top
J2  39.37,17.78 0 top
J3  41.91,5.08 0 top
J4  36.83,5.08 180 top
J5  33.02,48.26 180 top
J6  39.37,38.1 0 top
J7  3.81,31.93 270 top
J8  8.89,30.48 270 top
J9  8.89,7.62 90 top
J10  3.81,7.62 90 top
J11  39.37,12.7 0 top
J12  39.37,40.64 0 top
J13  39.37,35.56 0 top
J14  39.37,15.24 0 top
J15  17.78,48.26 180 top
JP1  46.99,45.72 180 bottom
JP2  40.64,45.72 180 bottom
JP3  34.29,45.72 180 bottom
JP4  27.94,45.72 180 bottom
JP5  31.11,16.51 90 bottom
JP6  33.66,16.51 90 bottom
JP7  29.84,36.83 90 bottom
JP8  32.38,36.83 90 bottom
JP9  24.13,16.51 0 bottom
JP10  21.59,36.83 0 top
JP11  27.94,8.26 180 bottom
LED1  2.54,16.38 180 top
LED2  2.54,38.23 180 top
LED3  2.54,17.78 0 top
LED4  2.54,36.83 0 top
LOGO1  12.7,14.86 90 bottom
LOGO2  18.16,10.16 0 top
R1  5.71,16.38 0 top
R2  5.71,17.78 0 top
R3  5.71,36.83 0 top
R4  5.71,38.23 0 top
R5  11.43,44.45 0 top
R6  11.43,3.81 0 top
R7  11.43,2.41 0 top
R8  11.43,43.05 0 top
U1  30.48,26.67 270 top
U2  29.21,26.67 90 top
U5  32.38,12.7 270 top
U6  29.21,40.13 180 top
U$1  20.32,40.64 0 top

### Tracks (layer width: path | path; a pad name or v marks a point on that pad's centre or on a via)
3.3V
  Top 0.61: J4.5 U1.3.3V
  Bottom 0.254: J4.5 26.67,6.35 26.92,6.6 JP11.1
  Bottom 0.61: U1.3.3V J4.5
5V
  Top 0.61: J4.4 U1.5V
  Bottom 0.254: J4.4 29.21,6.35 28.96,6.6 JP11.3
  Bottom 0.61: J4.4 U1.5V
D0
  Top 0.406: U1.RX J1.1
D1
  Top 0.406: U1.TX J1.2
D2
  Top 0.406: U1.D2 J1.3
  Bottom 0.254: J1.3 49.53,46.43 48.82,45.72 JP1.3
D3  (via drill 0.38)
  Top 0.254: v43.81,44.21 45.8,44.21 46.99,45.4 J1.4
  Top 0.406: U1.D3 J1.4
  Bottom 0.254: v43.81,44.21 42.94,45.09 42.94,45.48 42.7,45.72 JP2.3
D4  (via drill 0.38)
  Top 0.254: J1.5 44.45,47.15 43.97,46.67 38.97,46.67 37.78,45.48 v36.83,45.48
  Top 0.406: U1.D4 J1.5
  Bottom 0.254: 34.29,45.72 36.59,45.72 v36.83,45.48
D5
  Top 0.406: U1.D5 J1.6
D6
  Top 0.406: U1.D6 J1.7
D7
  Top 0.406: U1.D7 J1.8
  Bottom 0.254: J1.8 35.26,48.26 33.86,46.86 33.53,46.86 33.27,46.61 JP3.1
D8  (via drill 0.38)
  Top 0.254: J5.1 33.02,47.23 35.64,44.61 37.78,44.61 38.89,45.72 v43.77,45.72
  Top 0.406: U1.D8 J5.1
  Bottom 0.254: JP1.1 v43.77,45.72
D9  (via drill 0.38)
  Top 0.254: J5.2 30.48,46.83 31.51,45.8 32.23,45.8 35.48,42.55 v36.51,42.55
  Top 0.406: U1.D9 J5.2
  Bottom 0.254: v36.51,42.55 37.07,42.55 38.5,43.97 38.5,45.4 38.81,45.72 JP2.1
D10
  Top 0.406: U1.D10 J5.3
  Bottom 0.254: J5.3 26.92,47.24 JP4.1
D11  (via drill 0.38)
  Top 0.254: v30.48,45.56 29.37,46.67 25.72,46.67 25.4,46.99 J5.4
  Top 0.406: U1.D11 J5.4
  Bottom 0.254: JP4.3 30.32,45.72 v30.48,45.56
D12
  Top 0.406: U1.D12 J5.5
D13
  Top 0.406: U1.D13 J5.6
DIRA  (via drill 0.38)
  Top 0.254: U5.2 30.99,12.7 30.48,13.21 30.48,14.22 v31.11,14.86 37.21,14.86 v37.97,14.1 37.21,13.34 37.21,9.78 39.37,7.62 39.37,1.27 38.67,0.57 15.49,0.57 13.65,2.41 R7.2
  Bottom 0.254: v37.97,14.1 37.47,14.61 37.47,18.16 39.62,20.32 39.62,32.51 37.59,34.54 37.59,41.4 39.37,43.18 46.1,43.18 46.99,44.07 JP1.2 | v31.11,14.86 JP5.1
DIRB  (via drill 0.38)
  Top 0.254: R8.2 21.64,43.05 22.53,42.16 v29.21,42.16 U6.2
  Bottom 0.254: JP8.2 32.38,37.97 31.62,38.73 30.51,38.73 29.77,39.48 29.77,41.61 | JP3.2 34.29,42.16 33.77,41.64 29.8,41.64 29.77,41.61 | 29.77,41.61 v29.21,42.16
GND  (via drill 0.38, 0.51)
  Top 0.203: 10.16,26.67 7.62,26.67
  Bottom 0.203: 7.62,26.67 10.16,26.67
  other vias: 36.2,20.45 35.05,17.91 34.67,37.08 36.2,32.77 22.23,33.02 19.05,26.67 22.1,20.32 21.59,29.21 22.86,29.21 22.86,24.13 21.59,24.13 35.56,24.13 36.83,24.13 36.83,29.21 35.56,29.21 29.21,27.94 29.21,29.21 29.21,25.4 29.21,24.13 24.13,29.21 24.13,24.13 34.29,29.21 34.29,24.13 6.35,33.02 6.35,21.59 1.27,26.67 34.92,49.53 50.8,45.72 55.88,45.72 38.35,10.29 38.35,7.11 25.53,41.02 13.97,26.67 11.43,26.67 45.97,7.11 30.48,29.21 27.94,29.21 27.94,24.13 30.48,24.13 34.29,30.48 35.56,30.48 36.83,30.48 20.32,24.13 20.32,25.4 35.29,41.34 30.61,44.2 24.26,44.35 31.83,46.75 17.14,6.35 17.14,7.62 13.34,6.35 13.34,7.62 30.24,11.43 24.13,10.16 37.54,46.59 32.75,40.7
  pour Top (isolate 0.305): 0,53.34 0,0 59.69,0 59.69,53.34
  pour Bottom (isolate 0.305): 0,0 59.69,0 59.69,53.34 0,53.34
IN1  (via drill 0.38)
  Top 0.254: v31.11,18.41 U2.7 31.11,21.59 32,22.48 38.73,22.48 39.37,21.84 J2.1
  Bottom 0.254: v31.11,18.41 JP5.2
IN2  (via drill 0.38)
  Top 0.254: U2.9 v33.66,18.41 33.66,17.27 34.42,16.51 38.1,16.51 J14.1
  Bottom 0.254: v33.66,18.41 JP6.2
IN3  (via drill 0.38)
  Top 0.254: J6.1 34.16,38.1 JP8.1 v32.38,35.05 U2.13
  Bottom 0.254: v32.38,35.05 JP8.1
IN4  (via drill 0.38)
  Top 0.254: v29.84,34.92 U2.15 29.84,32 30.1,31.75 38.1,31.75 39.37,33.02 J13.1
  Bottom 0.254: v29.84,34.92 JP7.1
IOREF
  Top 0.406: J4.7 U1.IOREF
N$1  (via drill 1.02 pad 1.88)
  other vias: 41.91,25.4
N$2  (via drill 1.02 pad 1.88)
  other vias: 41.91,20.32
N$3  (via drill 1.02 pad 1.88)
  other vias: 54.61,38.1
N$4
  Top 0.254: LED1.A R1.1
N$5
  Top 0.254: LED3.C R2.1
N$6  (via drill 1.02 pad 1.88)
  other vias: 44.45,27.94
N$7  (via drill 1.02 pad 1.88)
  other vias: 41.91,27.94
N$8
  Top 0.254: LED4.C R3.1
N$9
  Top 0.254: LED2.A R4.1
N$10
  Top 0.406: U1.AREF J15.2
N$12  (via drill 1.02 pad 1.88)
  other vias: 54.61,30.48
N$15  (via drill 1.02 pad 1.88)
  other vias: 46.99,30.48
N$16  (via drill 1.02 pad 1.88)
  other vias: 49.53,30.48
N$17  (via drill 1.02 pad 1.88)
  other vias: 52.07,30.48
N$18  (via drill 1.02 pad 1.88)
  other vias: 54.61,40.64
N$19  (via drill 1.02 pad 1.88)
  other vias: 44.45,40.64
N$20  (via drill 1.02 pad 1.88)
  other vias: 46.99,40.64
N$21
  Top 0.406: J3.1 U1.A0
N$22
  Top 0.406: J3.2 U1.A1
N$23
  Top 0.406: J3.3 U1.A2
N$24
  Top 0.406: J3.4 U1.A3
N$25
  Top 0.406: J3.5 U1.A4
N$26
  Top 0.406: J3.6 U1.A5
N$27  (via drill 1.02 pad 1.88)
  other vias: 41.91,17.78
N$28  (via drill 1.02 pad 1.88)
  other vias: 49.53,40.64
N$29  (via drill 1.02 pad 1.88)
  other vias: 41.91,15.24
N$30  (via drill 1.02 pad 1.88)
  other vias: 52.07,40.64
N$31  (via drill 1.02 pad 1.88)
  other vias: 41.91,40.64
N$32  (via drill 1.02 pad 1.88)
  other vias: 41.91,30.48
N$33  (via drill 1.02 pad 1.88)
  other vias: 41.91,33.02
N$34  (via drill 1.02 pad 1.88)
  other vias: 41.91,35.56
N$35  (via drill 1.02 pad 1.88)
  other vias: 41.91,38.1
N$36
  Top 0.254: R5.1 D9.A
N$37
  Top 0.254: R6.1 D10.A
N$38
  Top 0.254: R8.1 D12.A
N$39
  Top 0.254: R7.1 D11.A
N$40  (via drill 1.02 pad 1.88)
  other vias: 41.91,12.7
N$41  (via drill 1.02 pad 1.88)
  other vias: 41.91,22.86
N$131  (via drill 1.02 pad 1.88)
  other vias: 54.61,12.7
N$157  (via drill 1.02 pad 1.88)
  other vias: 54.61,15.24
N$183  (via drill 1.02 pad 1.88)
  other vias: 54.61,17.78
N$209  (via drill 1.02 pad 1.88)
  other vias: 54.61,20.32
N$235  (via drill 1.02 pad 1.88)
  other vias: 54.61,22.86
N$261  (via drill 1.02 pad 1.88)
  other vias: 54.61,25.4
N$287  (via drill 1.02 pad 1.88)
  other vias: 54.61,27.94
N$313  (via drill 1.02 pad 1.88)
  other vias: 41.91,10.16
N$365  (via drill 1.02 pad 1.88)
  other vias: 44.45,17.78
N$366  (via drill 1.02 pad 1.88)
  other vias: 44.45,20.32
N$367  (via drill 1.02 pad 1.88)
  other vias: 44.45,22.86
N$368  (via drill 1.02 pad 1.88)
  other vias: 44.45,25.4
N$370  (via drill 1.02 pad 1.88)
  other vias: 52.07,10.16
N$371  (via drill 1.02 pad 1.88)
  other vias: 44.45,33.02
N$372  (via drill 1.02 pad 1.88)
  other vias: 44.45,35.56
N$373  (via drill 1.02 pad 1.88)
  other vias: 44.45,38.1
N$379  (via drill 1.02 pad 1.88)
  other vias: 44.45,12.7
N$380  (via drill 1.02 pad 1.88)
  other vias: 44.45,15.24
N$391  (via drill 1.02 pad 1.88)
  other vias: 46.99,17.78
N$392  (via drill 1.02 pad 1.88)
  other vias: 46.99,20.32
N$393  (via drill 1.02 pad 1.88)
  other vias: 46.99,22.86
N$394  (via drill 1.02 pad 1.88)
  other vias: 46.99,25.4
N$395  (via drill 1.02 pad 1.88)
  other vias: 46.99,27.94
N$396  (via drill 1.02 pad 1.88)
  other vias: 49.53,10.16
N$397  (via drill 1.02 pad 1.88)
  other vias: 46.99,33.02
N$398  (via drill 1.02 pad 1.88)
  other vias: 46.99,35.56
N$399  (via drill 1.02 pad 1.88)
  other vias: 46.99,38.1
N$405  (via drill 1.02 pad 1.88)
  other vias: 46.99,12.7
N$406  (via drill 1.02 pad 1.88)
  other vias: 46.99,15.24
N$417  (via drill 1.02 pad 1.88)
  other vias: 49.53,17.78
N$418  (via drill 1.02 pad 1.88)
  other vias: 49.53,20.32
N$419  (via drill 1.02 pad 1.88)
  other vias: 49.53,22.86
N$420  (via drill 1.02 pad 1.88)
  other vias: 49.53,25.4
N$421  (via drill 1.02 pad 1.88)
  other vias: 49.53,27.94
N$422  (via drill 1.02 pad 1.88)
  other vias: 46.99,10.16
N$423  (via drill 1.02 pad 1.88)
  other vias: 49.53,33.02
N$424  (via drill 1.02 pad 1.88)
  other vias: 49.53,35.56
N$425  (via drill 1.02 pad 1.88)
  other vias: 49.53,38.1
N$431  (via drill 1.02 pad 1.88)
  other vias: 49.53,12.7
N$432  (via drill 1.02 pad 1.88)
  other vias: 49.53,15.24
N$443  (via drill 1.02 pad 1.88)
  other vias: 52.07,17.78
N$444  (via drill 1.02 pad 1.88)
  other vias: 52.07,20.32
N$445  (via drill 1.02 pad 1.88)
  other vias: 52.07,22.86
N$446  (via drill 1.02 pad 1.88)
  other vias: 52.07,25.4
N$447  (via drill 1.02 pad 1.88)
  other vias: 52.07,27.94
N$448  (via drill 1.02 pad 1.88)
  other vias: 44.45,10.16
N$449  (via drill 1.02 pad 1.88)
  other vias: 52.07,33.02
N$450  (via drill 1.02 pad 1.88)
  other vias: 52.07,35.56
N$451  (via drill 1.02 pad 1.88)
  other vias: 52.07,38.1
N$457  (via drill 1.02 pad 1.88)
  other vias: 52.07,12.7
N$458  (via drill 1.02 pad 1.88)
  other vias: 52.07,15.24
N$511  (via drill 1.02 pad 1.88)
  other vias: 54.61,33.02
N$537  (via drill 1.02 pad 1.88)
  other vias: 54.61,35.56
N$547  (via drill 1.02 pad 1.88)
  other vias: 57.15,17.78
N$548  (via drill 1.02 pad 1.88)
  other vias: 57.15,20.32
N$549  (via drill 1.02 pad 1.88)
  other vias: 57.15,22.86
N$550  (via drill 1.02 pad 1.88)
  other vias: 57.15,25.4
N$551  (via drill 1.02 pad 1.88)
  other vias: 57.15,27.94
N$552  (via drill 1.02 pad 1.88)
  other vias: 57.15,30.48
N$553  (via drill 1.02 pad 1.88)
  other vias: 57.15,33.02
N$554  (via drill 1.02 pad 1.88)
  other vias: 57.15,35.56
N$561  (via drill 1.02 pad 1.88)
  other vias: 57.15,12.7
N$562  (via drill 1.02 pad 1.88)
  other vias: 57.15,15.24
N$1058  (via drill 1.02 pad 1.88)
  other vias: 44.45,30.48
NDIRA  (via drill 0.38)
  Top 0.254: U5.4 34.4,12.05 34.54,12.19 v34.54,13.72
  Bottom 0.254: v34.54,13.72 33.66,14.61 JP6.1
NDIRB  (via drill 0.38)
  Top 0.254: v27.94,37.72 28.19,37.72 28.57,38.1 28.57,39.17 U6.4
  Bottom 0.254: JP7.2 28.32,37.34 v27.94,37.72
OUT1
  Top 0.254: R1.2 R2.2 6.57,20.11 6.35,20.32 4.92,20.32 J7.4
  Top 0.61: U2.4 27.3,20.95 26.67,21.59 20.32,21.59 19.05,20.32 19.05,17.78 17.78,16.51 13.97,16.51 12.7,17.78 D1.A | D1.A 12.7,21.59 11.43,22.86 J8.4 5.08,22.86 3.81,21.59 J7.4 | D2.C D1.A
OUT2
  Top 0.254: J7.3 1.66,22.78 LED3.A LED1.C
  Top 0.61: U2.5 28.57,22.23 27.94,22.86 19.05,22.86 17.78,24.13 16.51,24.13 | J7.3 4.28,25.4 J8.3 12.7,25.4 13.97,24.13 16.51,24.13 | D3.A D4.C 16.51,24.13
OUT3
  Top 0.254: J7.2 1.66,30.57 LED4.A LED2.C
  Top 0.61: J7.2 4.3,27.94 J8.2 12.7,27.94 13.97,29.21 16.51,29.21 | U2.16 28.57,31.11 27.94,30.48 20.32,30.48 19.05,29.21 16.51,29.21 | 16.51,29.21 D6.C D5.A
OUT4
  Top 0.254: J7.1 3.81,33.02 5.08,34.29 6.35,34.29 6.57,34.51 R3.2 R4.2
  Top 0.61: D7.A 12.7,31.75 11.43,30.48 J8.1 5.26,30.48 J7.1 | D8.C D7.A | D7.A 12.7,35.56 13.97,36.83 17.78,36.83 19.05,35.56 19.05,33.02 20.32,31.75 26.92,31.75 27.3,32.13 U2.17
PWMA  (via drill 0.38)
  Top 0.254: U2.8 32.38,21.21 32.77,21.59 38.23,21.59 v38.35,21.46 | v13.97,3.81 R6.2
  Bottom 0.254: v13.97,3.81 14.73,3.05 14.73,1.33 15.49,0.57 38.67,0.57 39.37,1.27 J11.1 38.1,12.7 36.83,13.97 36.83,18.41 38.35,19.94 v38.35,21.46 38.99,22.1 38.99,32.26 36.83,34.42 36.83,41.51 39.03,43.71 40.06,43.71 40.64,44.29 JP2.2
PWMB  (via drill 0.38)
  Top 0.254: 34.29,40.64 v31.75,43.18 31.19,42.62 30.08,42.62 29.61,43.1 28.81,43.1 28.5,42.78 22.78,42.78 21.11,44.45 R5.2 | U2.14 31.11,37.47 34.29,40.64 | J12.1 38.77,40.05 34.88,40.05 34.29,40.64
  Bottom 0.254: v31.75,43.18 30.32,43.18 29.69,43.81 28.42,43.81 27.94,44.29 JP4.2
RESET
  Top 0.406: J4.6 U1.RES
SENA
  Top 0.61: U2.2 24.77,17.14 JP9.1 21.59,16.51
SENB
  Top 0.61: U2.19 24.77,36.2 JP10.2 21.59,36.83
VCCIO  (via drill 0.38)
  Top 0.254: C8.1 27.65,39.75 27.94,39.75 28.32,40.13 29.46,40.13 29.86,39.74 U6.5 30.93,39.18 31.27,39.53 v31.27,40.2 | U2.12 33.66,34.92 34.29,35.56 v34.92,35.56 | U5.5 32.78,13.35 32.51,13.08 32.51,11.39 C1.1 v35.56,10.67
  Bottom 0.254: 36.2,35.56 36.2,38.85 35.48,39.57 32.42,39.57 31.79,40.2 v31.27,40.2 | 36.2,35.56 36.2,34.16 38.35,32 38.35,22.99 37.34,21.97 37.34,19.81 36.2,18.67 36.2,12.22 35.56,11.59 v35.56,10.67 35.56,9.92 34.53,8.89 30.48,8.89 29.61,9.76 28.26,9.76 27.94,9.45 JP11.2 | v34.92,35.56 36.2,35.56
VIN  (via drill 0.38)
  Top 0.61: 15.24,14.36 D1.C 12.7,13.21 12.19,12.7 8.89,12.7 | 15.24,14.36 D3.C 16.9,13.97 20.32,13.97 | C3.+ 15.24,14.36 | U2.6 29.84,18.41 25.4,13.97 20.32,13.97 | 20.32,13.97 20.32,8.89 21.59,7.62 35.56,7.62 36.83,6.35 J4.1 U1.VIN | D7.C v12.7,40.64 v14.61,40.64 v16.51,40.64 D5.C | J10.2 6.04,11.12 7.62,12.7 8.89,12.7 | J9.2 8.89,12.7
  Bottom 0.61: J9.2 8.89,12.7 | 8.89,12.7 8.89,15.24 12.7,19.05 v12.7,40.64 v14.61,40.64 v16.51,40.64 | U1.VIN J4.1 | J10.2 6.04,11.12 7.62,12.7 8.89,12.7

### Text on the board
Bottom: v20
tPlace: AREF | GND | D13 | D12 | D11 | D10 | D9 | D8 | D7 | D6 | D5 | D4 | D3 | D2 | D1 | D0 | Ardumoto | TX | RX | PWMB | DIRB | Proto Area | PWM(EN)B | DRIVE B | IN3 | IN4 | SENSE B | 4 | B | 3 | 2 | A | 1 | SENSE A | IN1 | DRIVE A | IN2 | + | PWM / (EN)A | Max 18V | IOR | RES | 3.3V | 5V | GND | GND | VIN | A0 | A1 | A2 | A3 | A4 | A5 | - | PWMA | DIRA
bPlace: 10 | 1 | 1 | 7 | 4 | 9 | 3 | 8 | 2 | PWMB | DIRB | PWMA | DIRA | SELECT: | PWM(EN)B | IN3 | IN4 | IN4 | IN3 | 4 | ISOLATE | B | 3 | 2 | A | 1 | IN1 | IN2 | IN1 | ISOLATE | IN2 | PWM(EN)A | + | VCCIO | 3.3V | 5V | Proto Area | - | Max 18V
tValues: L298P013TR
tDocu: Pete Dokter | Revised by: Marshall Taylor